# EAGLE design instr_amp_ex (EAGLE 9.3.0)
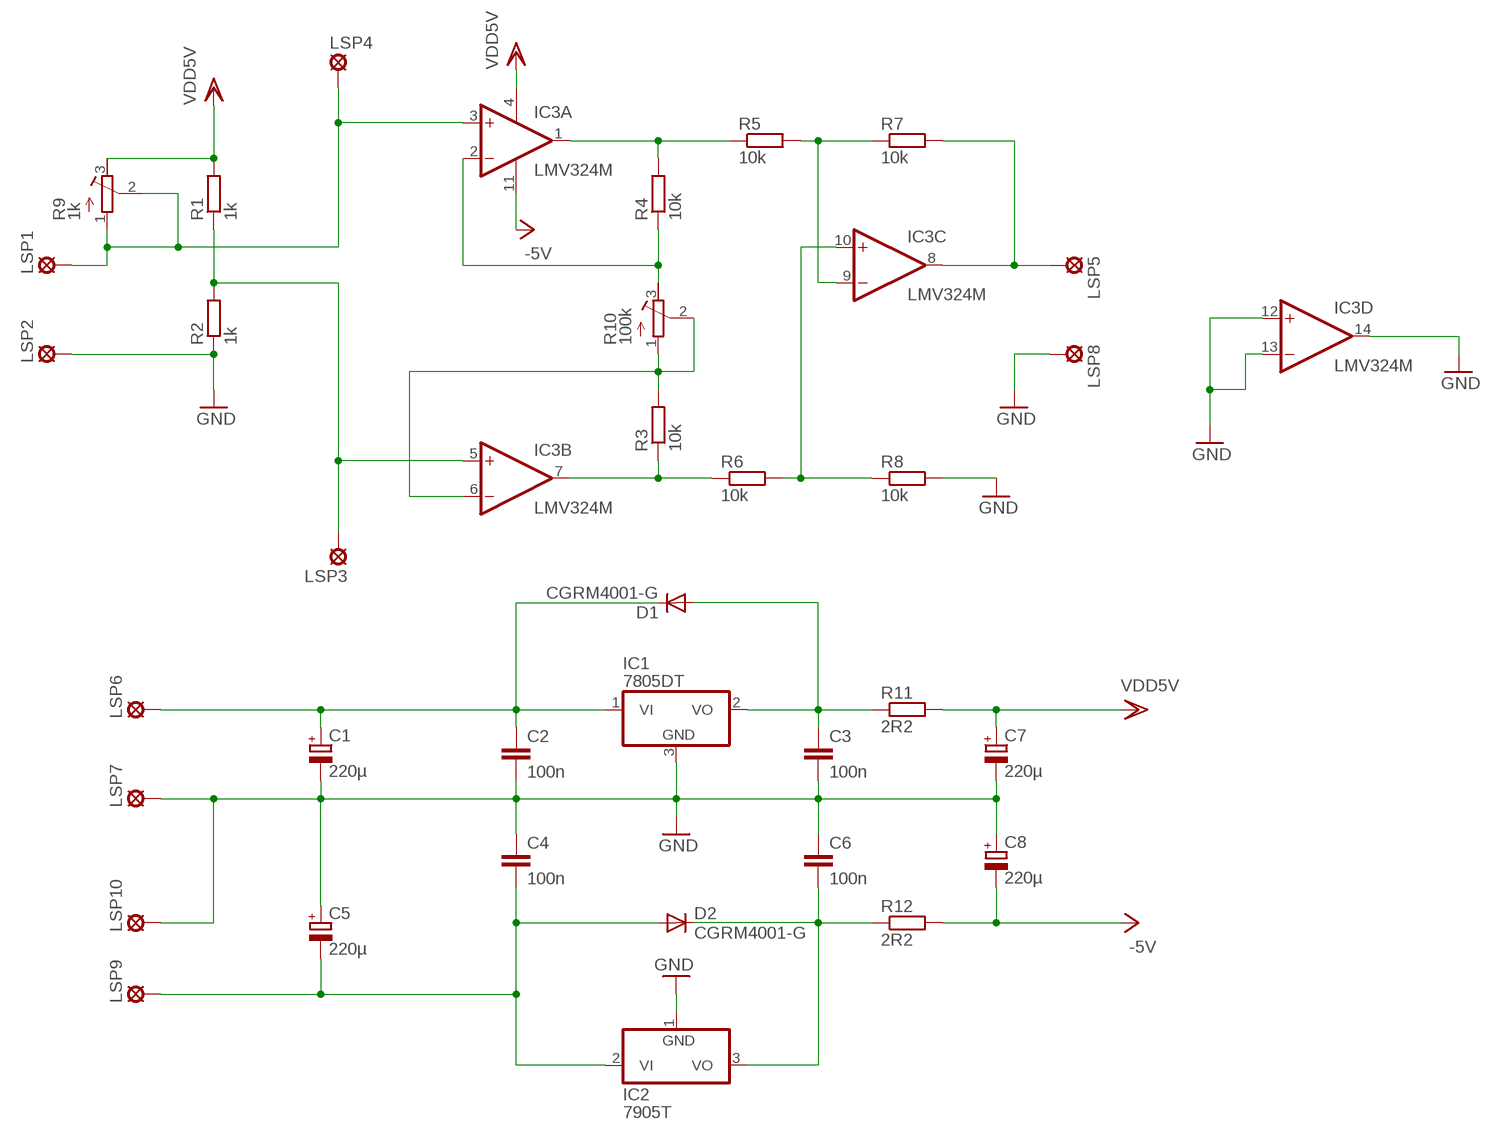
[diagram p0: schematic, sheet 1]

## Parts
C1  220µ  CPOL-EU085CS-1AW  [085CS_1AW]
C2  100n  C-EUC1206K  [C1206K]
C3  100n  C-EUC1206K  [C1206K]
C4  100n  C-EUC1206K  [C1206K]
C5  220µ  CPOL-EU085CS-1AW  [085CS_1AW]
C6  100n  C-EUC1206K  [C1206K]
C7  220µ  CPOL-EU085CS-1AW  [085CS_1AW]
C8  220µ  CPOL-EU085CS-1AW  [085CS_1AW]
D1  CGRM4001-G  [SOD-123_MINI-SMA]
D2  CGRM4001-G  [SOD-123_MINI-SMA]
IC1  7805DT  [TO252]
IC2  7905T  [TO220H]
IC3  LMV324M  [SO14]
LSP1  LSP13  [LSP13]
LSP2  LSP13  [LSP13]
LSP3  LSP13  [LSP13]
LSP4  LSP13  [LSP13]
LSP5  LSP13  [LSP13]
LSP6  LSP13  [LSP13]
LSP7  LSP13  [LSP13]
LSP8  LSP13  [LSP13]
LSP9  LSP13  [LSP13]
LSP10  LSP13  [LSP13]
R1  1k  R-EU_R1206  [R1206]
R2  1k  R-EU_R1206  [R1206]
R3  10k  R-EU_R1206  [R1206]
R4  10k  R-EU_R1206  [R1206]
R5  10k  R-EU_R1206  [R1206]
R6  10k  R-EU_R1206  [R1206]
R7  10k  R-EU_R1206  [R1206]
R8  10k  R-EU_R1206  [R1206]
R9  1k  R-TRIMM3224W  [RTRIM3224W]
R10  100k  R-TRIMM3224W  [RTRIM3224W]
R11  2R2  R-EU_R1206  [R1206]
R12  2R2  R-EU_R1206  [R1206]

## Nets
-5V: C8.- IC3.11(P:V-) R12.2
GND: C1.- C2.2 C3.2 C4.1 C5.+ C6.1 C7.- C8.+ IC1.3(GND) IC2.1(GND) IC3.12(D:+IN) IC3.13(D:-IN) IC3.14(D:OUT) LSP2.MP LSP7.MP LSP8.MP LSP10.MP R2.1 R8.2
N$1: IC3.5(B:+IN) LSP3.MP R1.1 R2.2
N$2: C3.1 D1.A IC1.2(VO) R11.1
N$3: IC3.3(A:+IN) LSP1.MP LSP4.MP R9.1(A) R9.2(S)
N$4: C6.2 D2.C IC2.3(VO) R12.1
N$5: IC3.1(A:OUT) R4.2 R5.1
N$6: IC3.10(C:+IN) R6.2 R8.1
N$7: IC3.7(B:OUT) R3.1 R6.1
N$8: C1.+ C2.1 D1.C IC1.1(VI) LSP6.MP
N$9: IC3.2(A:-IN) R4.1 R10.3(E)
N$10: IC3.9(C:-IN) R5.2 R7.1
N$11: IC3.8(C:OUT) LSP5.MP R7.2
N$13: IC3.6(B:-IN) R3.2 R10.1(A) R10.2(S)
N$15: C4.2 C5.- D2.A IC2.2(VI) LSP9.MP
VDD: C7.+ IC3.4(P:V+) R1.2 R9.3(E) R11.2 ; supply symbol labelled VDD5V

## Library data of the parts
C1 C5 C7 C8 = rcl:CPOL-EU: POLARIZED CAPACITOR, European symbol; SPICEPREFIX: C
C2-C4 C6 = rcl:C-EU: CAPACITOR, European symbol; SPICEPREFIX: C
D1 D2 = diode:CGRM400*-G: Molded plasitc,JEDEC SOD-123/Mini SMA Source: Comchip CGRM4001-G.pdf
IC1 = linear:78*: Positive VOLTAGE REGULATOR Source: http://cache.national.com/ds/LM/LM78L05.pdf http://www.fairchildsemi.com/ds/LM/LM7805.pdf
IC2 = linear:79*: Negative VOLTAGE REGULATOR
IC3 = linear:LMV324?*: Quad General Purpose, Low Voltage, Rail-to-Rail Output Operational Amplifiers Source: http://www.national.com/mpf/LM/LMV321.html http://www.national.com/dt/lmv_qual.pdf
LSP1-LSP10 = solpad:LSP13: SOLDER PAD drill 1.3 mm, distributor Buerklin, 12H562
R1-R8 R11 R12 = rcl:R-EU_: RESISTOR, European symbol; SPICEPREFIX: R
R9 R10 = rcl:R-TRIMM: Trimm resistor; SPICEMODEL: X; SPICEPREFIXL: POT

## Net classes
0 default: width 0.6 mm, drill 0.29 mm, clearance 0.6 mm

## Board
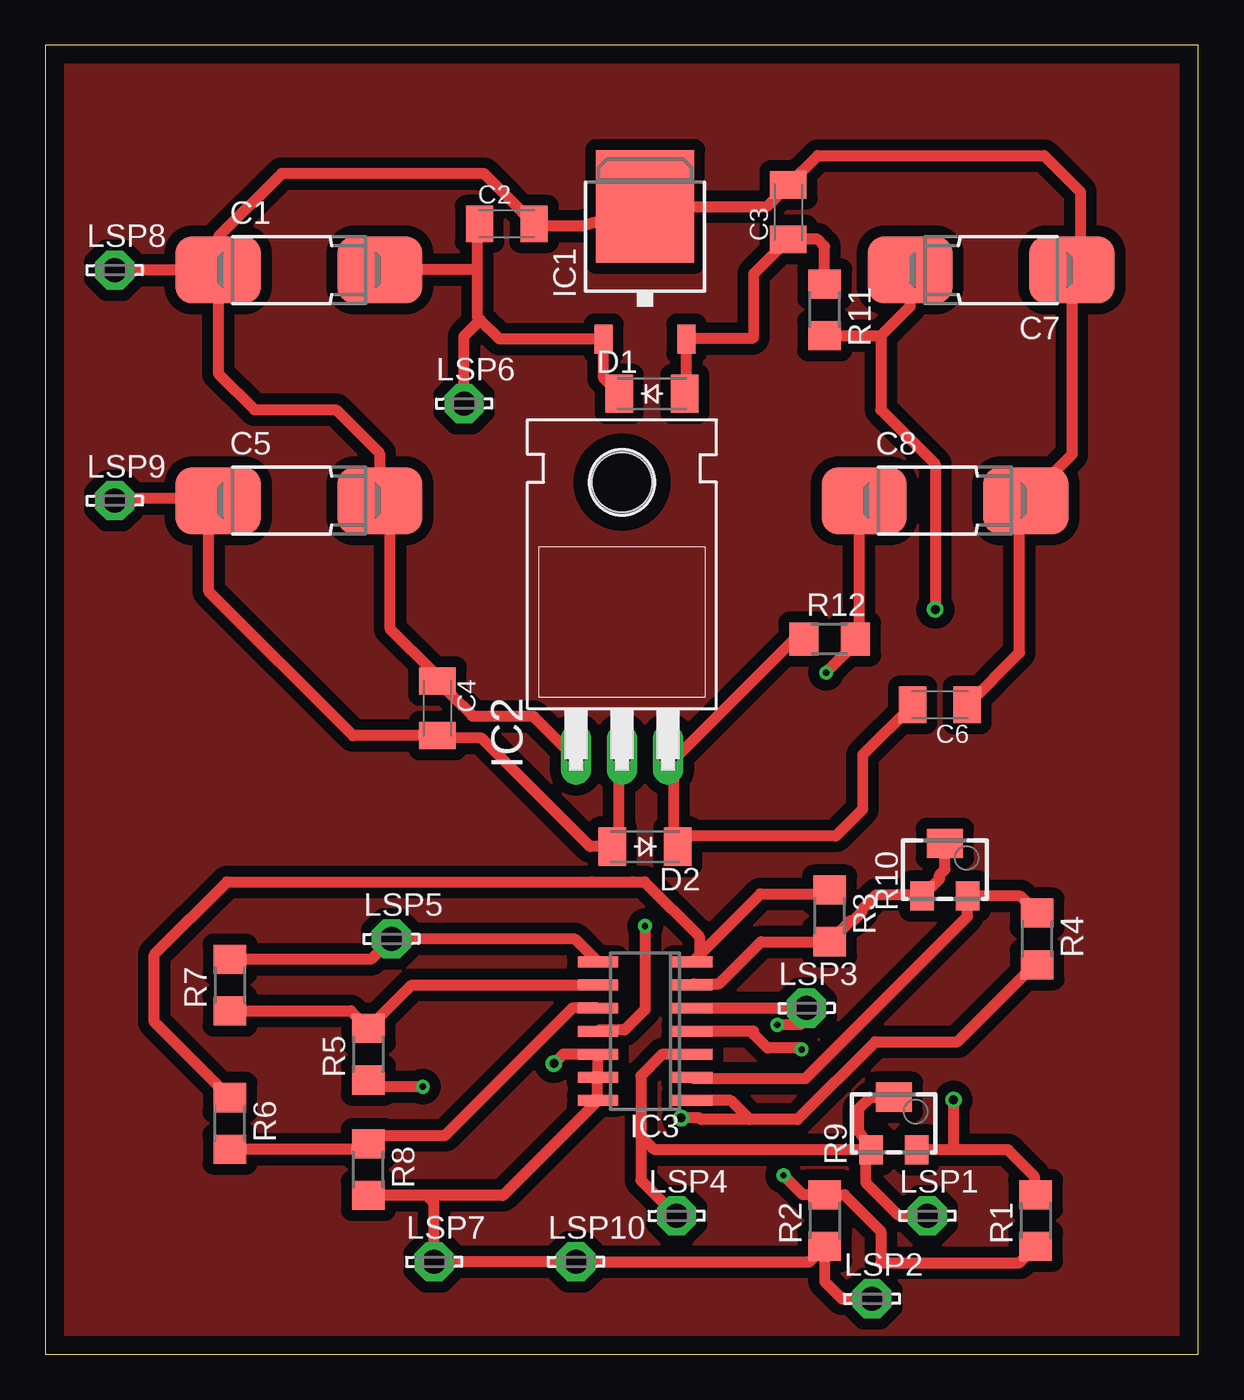
[diagram p1: board, top side]
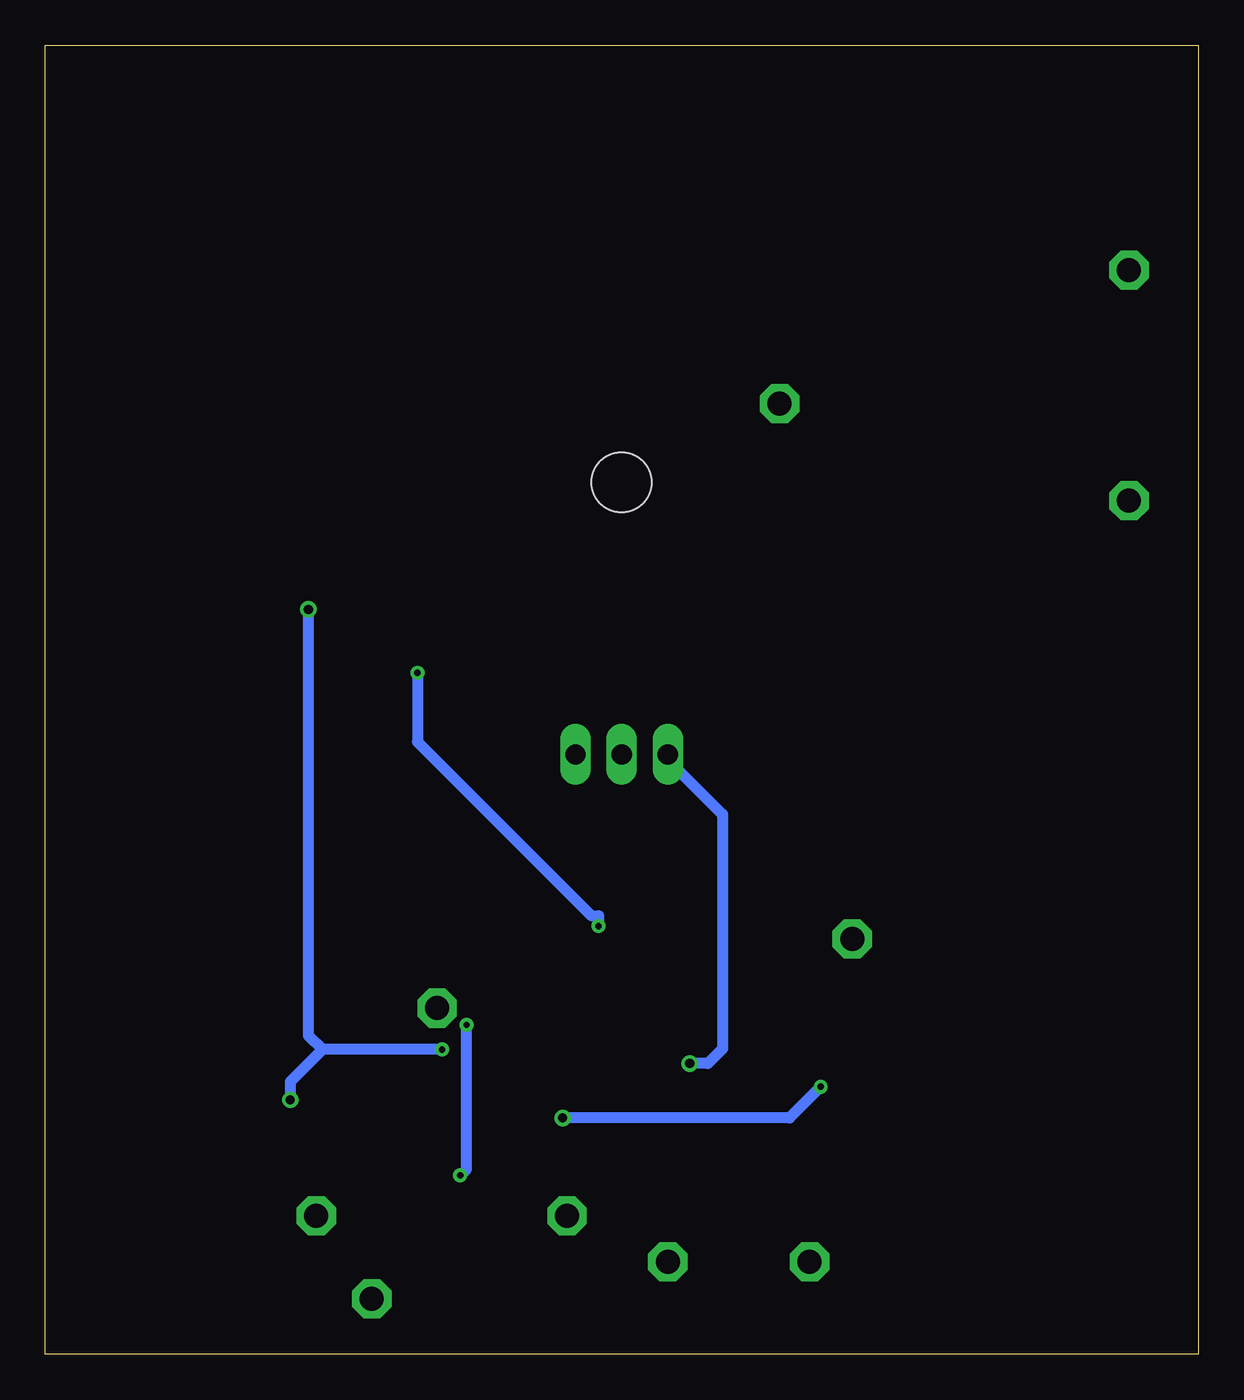
[diagram p2: board, bottom side, seen from below]

Size 63.48 x 72.06 mm. Coordinates in mm from the lower left corner, seen from the top.
Outline: 0,0 63.48,0 63.48,72.06 0,72.06 0,0
Copper layers (1*16): Top 0.035mm / dielectric 1.5mm / Bottom 0.035mm
Design rules "default": minimum track width 6mil, minimum drill 0.35mm, track to track 6mil, track to pad 6mil, pad to pad 6mil, via to via 6mil, smd to smd 6mil, copper to edge 40mil, drill to drill 6mil, minimum pad ring 10mil, minimum via ring 8mil, stop-mask expansion 4mil, vias tented up to drill 0mil, thermal gap 10mil

### Footprints (pad centres in the part's own frame; a part is rotated, then mirrored left to right if it is on the bottom)
085CS_1AW = smd 4.7 x 3.7: + 4.45,0; - -4.45,0
C1206K = smd 1.5 x 2: 1 -1.5,0; 2 1.5,0
SOD-123_MINI-SMA = smd 1.5 x 2.1: A 1.8,0; C -1.8,0
TO252 = smd 1 x 1.6: 1 -2.28,-4.8; 2 2.28,-4.8 | smd 5.4 x 6.2: 3 0,2.5
TO220H = drill 1.118 long: 1 -2.54,-10.16; 2 0,-10.16; 3 2.54,-10.16 | hole 3.302: 0,4.826
SO14 = smd 0.6 x 2.2: 1 -3.81,-2.6; 2 -2.54,-2.6; 3 -1.27,-2.6; 4 0,-2.6; 5 1.27,-2.6; 6 2.54,-2.6; 7 3.81,-2.6; 8 3.81,2.6; 9 2.54,2.6; 10 1.27,2.6; 11 0,2.6; 12 -1.27,2.6; 13 -2.54,2.6; 14 -3.81,2.6
LSP13 = drill 1.321 pad 2.159 octagon: MP 0,0
R1206 = smd 1.6 x 1.803: 1 -1.422,0; 2 1.422,0
RTRIM3224W = smd 1.3 x 1.6: 1 -1.25,-1.45; 3 1.25,-1.45 | smd 2 x 1.6: 2 0,1.45

### Placement (x,y rotation side)
C1  13.97,59.69 0 top
C2  25.4,62.23 0 top
C3  40.91,62.88 90 top
C4  21.59,35.56 270 top
C5  13.97,46.99 0 top
C6  49.26,35.75 180 top
C7  52.07,59.69 180 top
C8  49.53,46.99 0 top
D1  33.4,52.88 0 top
D2  33.02,27.94 180 top
IC1  33.02,60.69 0 top
IC2  31.75,43.18 0 top
IC3  33.02,17.78 90 top
LSP1  48.56,7.62 0 top
LSP2  45.51,3.04 0 top
LSP3  41.91,19.05 0 top
LSP4  34.75,7.62 0 top
LSP5  19.05,22.86 0 top
LSP6  23.05,52.34 0 top
LSP7  21.4,5.08 0 top
LSP8  3.81,59.69 0 top
LSP9  3.81,46.99 0 top
LSP10  29.21,5.08 0 top
R1  54.53,7.35 90 top
R2  42.91,7.35 90 top
R3  43.18,24.13 270 top
R4  54.61,22.86 270 top
R5  17.78,16.51 90 top
R6  10.16,12.7 270 top
R7  10.16,20.32 90 top
R8  17.78,10.16 270 top
R9  46.72,12.7 0 top
R10  49.53,26.67 0 top
R11  42.91,57.5 270 top
R12  43.18,39.37 0 top

### Tracks (layer width: path | path; a pad name or v marks a point on that pad's centre or on a via)
-5V  (via drill 0.35)
  Top 0.6: C8.- 44.79,46.52 44.79,39.92 R12.2 44.79,39.32 v42.99,37.52 | IC3.11 30.48,17.84 31.89,17.84 33.02,18.98 v33.02,23.57
  Bottom 0.6: v42.99,37.52 42.99,33.71 33.41,24.13 33.02,24.13 v33.02,23.57
GND  (via drill 0.5)
  Top 0.6: 53.79,46.52 C8.+ | C8.+ 53.79,47.12 53.63,47.28 53.63,38.62 C6.1 | LSP8.MP 3.99,59.72 4.02,59.69 C1.- | 30.39,16.52 30.39,15.32 | 30.39,16.52 IC3.12 | 30.39,15.32 30.39,14.12 IC3.14 25.19,8.74 21,8.74 | 30.39,15.32 IC3.13 | C1.- 9.52,54 11.52,52 16,52 18.39,49.61 18.39,47.12 C5.+ 18.99,46.52 18.99,39.92 21.39,37.52 C4.1 22.94,35.71 22.96,35.71 23.49,35.18 23.49,35.16 23.53,35.12 26.88,35.12 28.98,33.02 IC2.1 | LSP2.MP 43.87,3.04 42.91,4 R2.1 42.06,5.08 LSP10.MP LSP7.MP 21.4,8.34 21,8.74 | C1.- 9.52,61.52 13,65 24.15,65 25.55,63.6 25.55,63.58 C2.2 27.39,62.12 29.5,62.12 IC1.3 39.72,63.19 C3.2 42.53,66 55,66 57,64 57,60 56.69,59.69 C7.- 56.52,49.53 C8.+ | 21,8.74 R8.2 | v28,16 28.52,16.52 30.39,16.52
  Bottom 0.6: IC2.1 29.19,32.72 26.19,29.72 26.19,16.81 27,16 v28,16
N$1  (via drill 0.35)
  Top 0.6: IC3.5 LSP3.MP 41.91,18.48 41.56,18.13 v40.29,18.13 | v40.64,9.84 41.71,8.77 R2.2 44,8.77 46,6.77 46,5.02 53.62,5.02 R1.1
  Bottom 0.6: v40.64,9.84 40.61,9.84 40.29,10.16 v40.29,18.13
N$2
  Top 0.6: R11.1 42.91,61 42.53,61.38 C3.1 39,59.47 39,56 38.92,55.92 35.19,55.92 35.22,55.89 IC1.2 35.3,52.98 D1.A
N$3
  Top 0.6: IC3.3 35.19,16.52 33.99,16.52 32.79,15.32 32.79,12 | R9.1 44.79,12.25 44.79,13.52 45.42,14.15 R9.2 | R9.1 45.19,11.12 45.19,9.43 47,7.62 LSP1.MP | LSP4.MP 32.79,9.58 32.79,12 | R9.1 33.54,11.25 32.79,12
N$4
  Top 0.6: 34.59,32.72 41.19,39.32 R12.1 | 34.59,32.72 34.59,28.52 D2.C 35.19,28.52 43.52,28.52 45,30 45,32.99 C6.2 | 34.59,32.72 IC2.3
N$5  (via drill 0.35, 0.5)
  Top 0.6: v20.79,14.72 18.28,14.72 R5.1 | IC3.1 37.74,13.97 38.79,12.92 | R4.2 54.6,21.6 54.61,21.59 50.22,17.2 45.7,17.2 41.42,12.92 38.79,12.92 | v35,13.01 36.04,13.01 36.12,12.92 38.79,12.92
  Bottom 0.6: v20.79,14.72 22.5,13.01 v35,13.01
N$6
  Top 0.6: IC3.10 29.02,19.05 22,12.03 18.23,12.03 R8.1 17.48,11.28 R6.2
N$7
  Top 0.6: R3.1 43.18,25.34 39.37,25.34 IC3.7 36.02,21.98 36.02,22.98 33,26 32.35,26 32.34,25.99 30.1,25.99 30.09,26 10,26 6,22 6,18.28 R6.1
N$8
  Top 0.6: 23.79,59.72 23.79,62.12 C2.1 | 23.79,59.72 18.99,59.72 C1.+ | D1.C 30.74,53.74 IC1.1 25,55.89 23.95,56.95 | 23.95,56.95 23.79,57.1 23.79,59.72 | LSP6.MP 23.05,56.05 23.95,56.95
N$9
  Top 0.6: IC3.2 35.69,15.17 41.84,15.17 50.78,24.11 R10.3 53.67,25.22 R4.1
N$10
  Top 0.6: IC3.9 20.17,20.32 R5.2 16.81,18.9 R7.1
N$11
  Top 0.6: IC3.8 29.15,22.86 LSP5.MP 17.93,21.74 R7.2
N$13
  Top 0.6: R10.2 49.53,26.69 49.23,26.39 49.23,26.17 R10.1 48.36,25.3 45.77,25.3 44.98,24.51 44.98,24.38 44.45,23.85 44.32,23.85 R3.2 39.41,22.71 37.09,20.39 35.69,20.39 IC3.6
N$15
  Top 0.6: 9,47.12 9.39,47.12 C5.- 9.99,46.52 | 9,47.12 3.99,47.12 LSP9.MP | C4.2 21.99,33.92 24.02,33.92 30,27.94 D2.A | 30.99,27.92 D2.A | IC2.2 31.59,32.72 31.59,28.52 D2.A | 21.39,33.92 C4.2 | C4.2 16.94,34.06 9,42 9,47.12
POLYGON
  pour Top: 0,72.39 0,0 63.5,0 63.5,72.39
VDD  (via drill 0.35, 0.5)
  Top 0.6: R1.2 54.45,8.77 54.45,9.8 53,11.25 50,11.25 | IC3.4 39.01,17.78 39.01,17.6 39.76,16.85 41.56,16.85 v41.64,16.77 | R11.2 46,56.08 | 46,56.08 47.62,57.7 C7.+ | 50,11.25 R9.3 | v50,14 50,11.25 | 46,56.08 46,52 49,49 v49,41
  Bottom 0.6: v41.64,16.77 48.23,16.77 | 48.23,16.77 50,15 v50,14 | v49,41 49,17.55 48.23,16.77